# EAGLE design LickSensor (EAGLE 9.4.2)
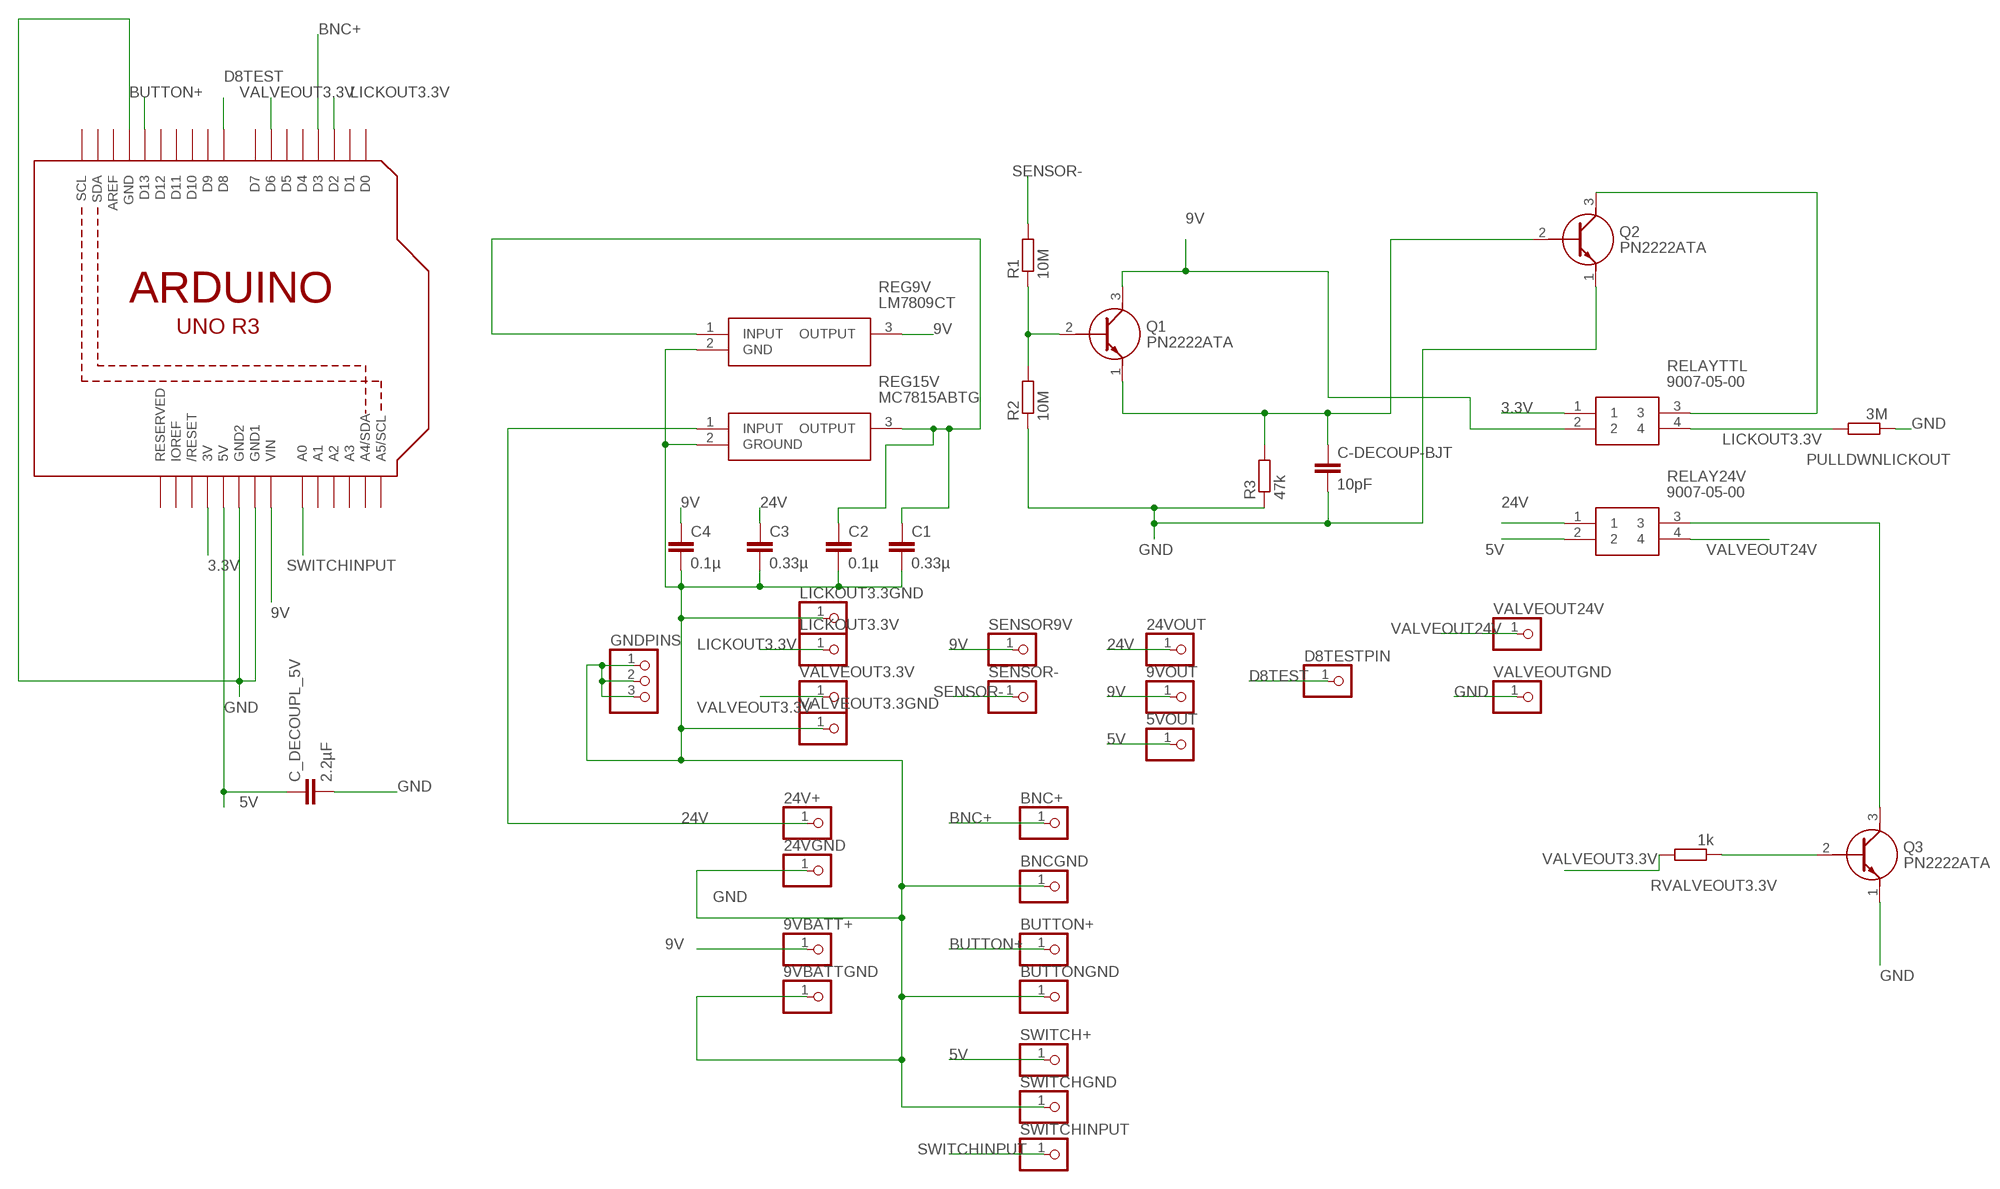
[diagram p0: schematic, sheet 1]

## Parts
5VOUT  PINHD-1X1  [1X01]
9VBATT+  PINHD-1X1  [1X01]
9VBATTGND  PINHD-1X1  [1X01]
9VOUT  PINHD-1X1  [1X01]
24V+  PINHD-1X1  [1X01]
24VGND  PINHD-1X1  [1X01]
24VOUT  PINHD-1X1  [1X01]
BNC+  PINHD-1X1  [1X01]
BNCGND  PINHD-1X1  [1X01]
BUTTON+  PINHD-1X1  [1X01]
BUTTONGND  PINHD-1X1  [1X01]
C1  0.33µ  C5/2.5  [C5B2.5]
C2  0.1µ  C5/2.5  [C5B2.5]
C3  0.33µ  C5/2.5  [C5B2.5]
C4  0.1µ  C5/2.5  [C5B2.5]
C-DECOUP-BJT  10pF  C-EU050-030X075  [C050-030X075]
C_DECOUPL_5V  2.2µF  C-EU050-030X075  [C050-030X075]
D8TESTPIN  PINHD-1X1  [1X01]
GNDPINS  PINHD-1X3  [1X03]
LICKOUT3.3GND  PINHD-1X1  [1X01]
LICKOUT3.3V  PINHD-1X1  [1X01]
PULLDWNLICKOUT  3M  R-EU_0207/10  [0207/10]
Q1  PN2222ATA  [TO-92-3]
Q2  PN2222ATA  [TO-92-3]
Q3  PN2222ATA  [TO-92-3]
R1  10M  R-EU_0207/7  [0207/7]
R2  10M  R-EU_0207/7  [0207/7]
R3  47k  R-EU_0207/7  [0207/7]
REG9V  LM7809CT  [TO254P470X1016X2019-3P]
REG15V  MC7815ABTG  [TO254P482X997X2018-3P]
RELAY24V  9007-05-00  [9007]
RELAYTTL  9007-05-00  [9007]
RVALVEOUT3.3V  1k  R-EU_0207/10  [0207/10]
SENSOR9V  PINHD-1X1  [1X01]
SENSOR-  PINHD-1X1  [1X01]
SWITCH+  PINHD-1X1  [1X01]
SWITCHGND  PINHD-1X1  [1X01]
SWITCHINPUT  PINHD-1X1  [1X01]
U1  ARDUINOR3-DIMENSION  [ARDUINOR3]
VALVEOUT3.3GND  PINHD-1X1  [1X01]
VALVEOUT3.3V  PINHD-1X1  [1X01]
VALVEOUT24V  PINHD-1X1  [1X01]
VALVEOUTGND  PINHD-1X1  [1X01]

## Nets
3.3V: RELAYTTL.1 U1.3V
5V: 5VOUT.1 C_DECOUPL_5V.1 RELAY24V.2 SWITCH+.1 U1.5V
9V: 9VBATT+.1 9VOUT.1 C4.1 Q1.3(C) REG9V.3(OUTPUT) RELAYTTL.2 SENSOR9V.1 U1.VIN
24V: 24V+.1 24VOUT.1 C3.1 REG15V.1(INPUT) RELAY24V.1
BNC+: BNC+.1 U1.D3
BUTTON+: BUTTON+.1 U1.D13
D8TEST: D8TESTPIN.1 U1.D8
GND: 9VBATTGND.1 24VGND.1 BNCGND.1 BUTTONGND.1 C1.2 C2.2 C3.2 C4.2 C-DECOUP-BJT.2 C_DECOUPL_5V.2 GNDPINS.1 GNDPINS.2 GNDPINS.3 LICKOUT3.3GND.1 PULLDWNLICKOUT.1 Q2.1(E) Q3.1(E) R2.1 R3.1 REG9V.2(GND) REG15V.2(GROUND) SWITCHGND.1 U1.GND U1.GND1 U1.GND2 VALVEOUT3.3GND.1 VALVEOUTGND.1
LICKOUT3.3V: LICKOUT3.3V.1 PULLDWNLICKOUT.2 RELAYTTL.4 U1.D2
N$1: Q3.2(B) RVALVEOUT3.3V.1
N$3: Q3.3(C) RELAY24V.3
N$5: C1.1 C2.1 REG9V.1(INPUT) REG15V.3(OUTPUT)
N$10: C-DECOUP-BJT.1 Q1.1(E) Q2.2(B) R3.2
N$11: Q1.2(B) R1.1 R2.2
N$14: Q2.3(C) RELAYTTL.3
SENSOR-: R1.2 SENSOR-.1
SWITCHINPUT: SWITCHINPUT.1 U1.A0
VALVEOUT3.3V: RVALVEOUT3.3V.2 U1.D6 VALVEOUT3.3V.1
VALVEOUT24V: RELAY24V.4 VALVEOUT24V.1
Unconnected: U1.A1 U1.A2 U1.A3 U1.A4(A4/SDA) U1.A5(A5/SCL) U1.AREF U1.D0 U1.D1 U1.D4 U1.D5 U1.D7 U1.D9 U1.D10 U1.D11 U1.D12 U1.IOREF U1.RESERVED U1.RESET(/RESET) U1.SCL U1.SDA

## Library data of the parts
5VOUT 9VBATT+ 9VBATTGND 9VOUT 24V+ 24VGND 24VOUT BNC+ BNCGND BUTTON+ BUTTONGND D8TESTPIN LICKOUT3.3GND LICKOUT3.3V SENSOR9V SENSOR- SWITCH+ SWITCHGND SWITCHINPUT VALVEOUT3.3GND VALVEOUT3.3V VALVEOUT24V VALVEOUTGND = adafruit:PINHD-1X1: Pin header 1x1 for 0.1" spacing With round pins
C1-C4 = capacitor-wima:C: CAPACITOR naming: grid - package width
C-DECOUP-BJT C_DECOUPL_5V = rcl:C-EU: CAPACITOR, European symbol; SPICEPREFIX: C
GNDPINS = adafruit:PINHD-1X3: PIN HEADER
PULLDWNLICKOUT R1-R3 RVALVEOUT3.3V = rcl:R-EU_: RESISTOR, European symbol; SPICEPREFIX: R
Q1-Q3 = SamacSys_Parts:PN2222ATA: Transistor GP BJT NPN 40V 1A TO92 3 Pin Source: Datasheet <https://componentsearchengine.com/Datasheets/2/PN2222ATA.pdf>; DESCRIPTION: Transistor GP BJT NPN 40V 1A TO92 3 Pin; HEIGHT: mm; MANUFACTURER_NAME: Fairchild Semiconductor; MANUFACTURER_PART_NUMBER: PN2222ATA; MOUSER_PART_NUMBER: 512-PN2222ATA; MOUSER_PRICE-STOCK: https://www.mouser.com/Search/Refine.aspx?Keyword=512-PN2222ATA
REG9V = SamacSys_Parts:LM7809CT: ON SEMICONDUCTOR - LM7809CT - LINEAR VOLT REG, 1A, 9V, TO-220AB-3 Source: Datasheet <https://mouser.componentsearchengine.com/Datasheets/2/LM7809CT.pdf>; DESCRIPTION: ON SEMICONDUCTOR - LM7809CT - LINEAR VOLT REG, 1A, 9V, TO-220AB-3; HEIGHT: 4.7mm; MANUFACTURER_NAME: ON Semiconductor; MANUFACTURER_PART_NUMBER: LM7809CT; MOUSER_PART_NUMBER: 512-LM7809CT; MOUSER_PRICE-STOCK: https://www.mouser.com/Search/Refine.aspx?Keyword=512-LM7809CT; RS_PART_NUMBER: 7044016; RS_PRICE-STOCK: https://uk.rs-online.com/web/p/products/7044016
REG15V = SamacSys_Parts:MC7815ABTG: MC7815ABTG, Voltage Regulator, 2.2A 15 V, +/-2%, 3-Pin TO-220 Source: Datasheet <http://www.onsemi.com/pub/Collateral/MC7800-D.PDF>; ALLIED_NUMBER: 70340130; ALLIED_PRICE-STOCK: http://www.alliedelec.com/on-semiconductor-mc7815abtg/70340130/; DESCRIPTION: MC7815ABTG, Voltage Regulator, 2.2A 15 V, +/-2%, 3-Pin TO-220; HEIGHT: 4.82mm; MANUFACTURER_NAME: ON Semiconductor; MANUFACTURER_PART_NUMBER: MC7815ABTG; MOUSER_PART_NUMBER: 863-MC7815ABTG; MOUSER_PRICE-STOCK: https://www.mouser.com/Search/Refine.aspx?Keyword=863-MC7815ABTG; RS_PART_NUMBER: 5165944P; RS_PRICE-STOCK: http://uk.rs-online.com/web/p/products/5165944P
RELAY24V RELAYTTL = SamacSys_Parts:9007-05-00: COTO TECHNOLOGY - 9007-05-00 - RELAY, REED, SPST-NO, 200V, 0.5A, THT Source: Datasheet <https://cotorelay.com/wp-content/uploads/2014/09/9007_series_reed_relay_datasheet.pdf>; DESCRIPTION: COTO TECHNOLOGY - 9007-05-00 - RELAY, REED, SPST-NO, 200V, 0.5A, THT; HEIGHT: mm; MANUFACTURER_NAME: Coto Technology; MANUFACTURER_PART_NUMBER: 9007-05-00; MOUSER_PART_NUMBER: 816-9007-05-00; MOUSER_PRICE-STOCK: https://www.mouser.com/Search/Refine.aspx?Keyword=816-9007-05-00
U1 = adafruit:ARDUINOR3: This is a new object for the new Arduino R3 - with extra pins that you may want to use (such as IOref, and duplicated A4/A5

## Board
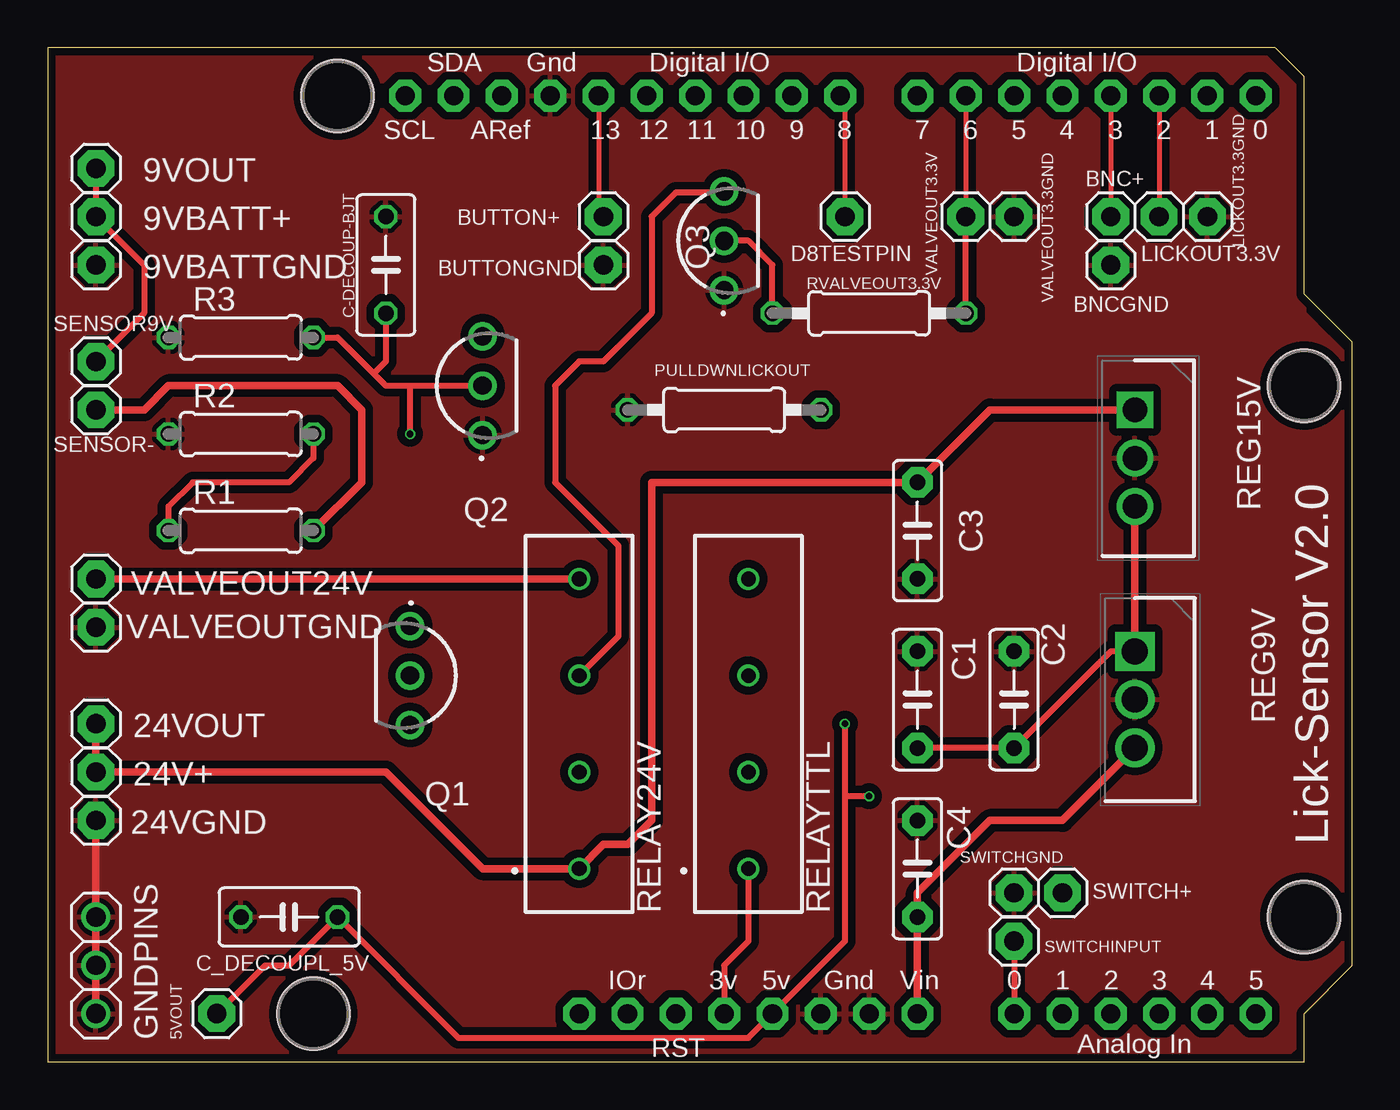
[diagram p1: board, top side]
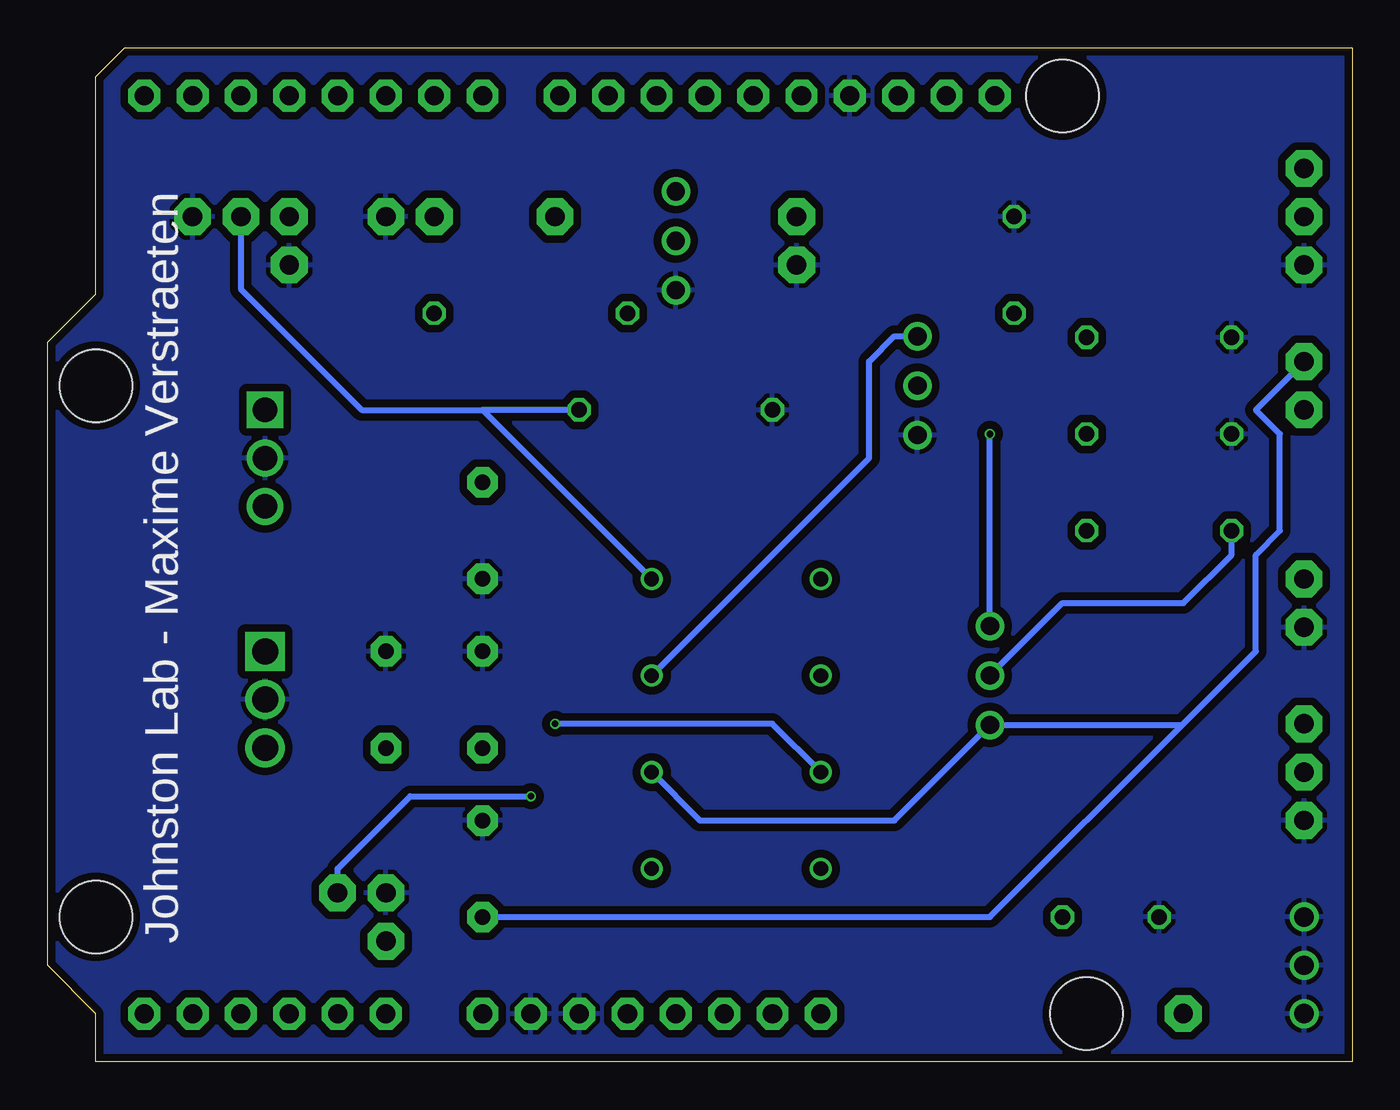
[diagram p2: board, bottom side, seen from below]

Size 68.58 x 53.34 mm. Coordinates in mm from the lower left corner, seen from the top.
Copper layers (1*16): Top 0.035559375mm / dielectric 1.6mm / Bottom 0.035559375mm
Design rules "jlcpcb2layer": minimum track width 5mil, minimum drill 12mil, track to track 5mil, track to pad 5mil, pad to pad 5mil, via to via 5mil, smd to smd 5mil, copper to edge 8mil, drill to drill 6mil, minimum pad ring 5mil, minimum via ring 3mil, stop-mask expansion 2.5mil, vias tented up to drill 0mil, thermal gap 10mil
Holes 3.81 mm at 15.24,50.8 66.04,35.56 66.04,7.62 13.97,2.54

### Footprints (pad centres in the part's own frame; a part is rotated, then mirrored left to right if it is on the bottom)
1X01 = drill 1.016 pad 1.93 octagon: 1 0,0
C5B2.5 = drill 0.813 pad 1.6 octagon: 1 -2.54,0; 2 2.54,0
C050-030X075 = drill 0.813 octagon: 1 -2.54,0; 2 2.54,0
1X03 = drill 1.016: 1 -2.54,0; 2 0,0; 3 2.54,0
0207/10 = drill 0.813 octagon: 1 -5.08,0; 2 5.08,0
TO-92-3 = drill 0.96 pad 1.5: 1 -2.6,0; 2 0,0; 3 2.6,0
0207/7 = drill 0.813 octagon: 1 -3.81,0; 2 3.81,0
TO254P470X1016X2019-3P = drill 1.37 pad 2.055 square: 1 0,0 | drill 1.37 pad 2.055: 2 2.535,0; 3 5.07,0
TO254P482X997X2018-3P = drill 1.29 pad 1.935 square: 1 0,0 | drill 1.29 pad 1.935: 2 2.54,0; 3 5.08,0
9007 = drill 0.77 pad 1.17: 1 -7.62,0; 2 -2.54,0; 3 2.54,0; 4 7.62,0
ARDUINOR3 = drill 1 pad 1.676 octagon: 3V 35.56,2.54; 5V 38.1,2.54; A0 50.8,2.54; A1 53.34,2.54; A2 55.88,2.54; A3 58.42,2.54; A4 60.96,2.54; A5 63.5,2.54; AREF 23.876,50.8; D0 63.5,50.8; D1 60.96,50.8; D2 58.42,50.8; D3 55.88,50.8; D4 53.34,50.8; D5 50.8,50.8; D6 48.26,50.8; D7 45.72,50.8; D8 41.656,50.8; D9 39.116,50.8; D10 36.576,50.8; D11 34.036,50.8; D12 31.496,50.8; D13 28.956,50.8; GND 26.416,50.8; GND1 43.18,2.54; GND2 40.64,2.54; IOREF 30.48,2.54; RESERVED 27.94,2.54; RESET 33.02,2.54; SCL 18.796,50.8; SDA 21.336,50.8; VIN 45.72,2.54

### Placement (x,y rotation side)
5VOUT  8.89,2.54 0 top
9VBATT+  2.54,44.45 0 top
9VBATTGND  2.54,41.91 0 top
9VOUT  2.54,46.99 0 top
24V+  2.54,15.24 0 top
24VGND  2.54,12.7 0 top
24VOUT  2.54,17.78 0 top
BNC+  55.88,44.45 0 top
BNCGND  55.88,41.91 0 top
BUTTON+  29.21,44.45 0 top
BUTTONGND  29.21,41.91 0 top
C1  45.72,19.05 90 top
C2  50.8,19.05 90 top
C3  45.72,27.94 270 top
C4  45.72,10.16 90 top
C-DECOUP-BJT  17.78,41.91 90 top
C_DECOUPL_5V  12.7,7.62 180 top
D8TESTPIN  41.91,44.45 0 top
GNDPINS  2.54,5.08 90 top
LICKOUT3.3GND  60.96,44.45 0 top
LICKOUT3.3V  58.42,44.45 0 top
PULLDWNLICKOUT  35.56,34.29 0 top
Q1  19.05,20.32 270 top
Q2  22.86,35.56 90 top
Q3  35.56,43.18 90 top
R1  10.16,27.94 0 top
R2  10.16,33.02 0 top
R3  10.16,38.1 0 top
REG9V  57.15,21.59 270 top
REG15V  57.15,34.29 270 top
RELAY24V  27.94,17.78 90 top
RELAYTTL  36.83,17.78 90 top
RVALVEOUT3.3V  43.18,39.37 0 top
SENSOR9V  2.54,36.83 0 top
SENSOR-  2.54,34.29 0 top
SWITCH+  53.34,8.89 0 top
SWITCHGND  50.8,8.89 0 top
SWITCHINPUT  50.8,6.35 0 top
U1  0,0 0 top
VALVEOUT3.3GND  50.8,44.45 0 top
VALVEOUT3.3V  48.26,44.45 0 top
VALVEOUT24V  2.54,25.4 0 top
VALVEOUTGND  2.54,22.86 0 top

### Tracks (layer width: path | path; a pad name or v marks a point on that pad's centre or on a via)
3.3V
  Top 0.305: RELAYTTL.1 36.83,6.35 35.56,5.08 U1.3V
5V  (via drill 0.35)
  Top 0.305: v41.91,17.78 41.91,13.97 | 41.91,13.97 41.91,6.35 U1.5V 36.83,1.27 21.59,1.27 C_DECOUPL_5V.1 12.7,5.08 11.43,5.08 5VOUT.1 | v43.18,13.97 41.91,13.97
  Bottom 0.305: RELAY24V.2 30.48,17.78 v41.91,17.78 | SWITCH+.1 53.34,10.16 49.53,13.97 v43.18,13.97
9V
  Top 0.305: 9VOUT.1 9VBATT+.1 5.08,41.91 5.08,39.37 SENSOR9V.1
  Top 0.406: U1.VIN C4.1 45.72,8.89 49.53,12.7 53.33,12.7 REG9V.3
  Bottom 0.305: C4.1 19.05,7.62 8.95,17.72 | SENSOR9V.1 5.08,34.29 3.81,33.02 3.81,27.94 5.08,26.67 5.08,21.59 8.89,17.78 8.95,17.72 | RELAYTTL.2 34.29,12.7 24.07,12.7 Q1.3 8.95,17.72
24V
  Top 0.406: 24VOUT.1 24V+.1 17.78,15.24 22.86,10.16 RELAY24V.1 29.21,11.43 30.48,11.43 31.75,12.7 31.75,30.48 C3.1 49.53,34.29 REG15V.1
BNC+
  Top 0.254: U1.D3 BNC+.1
BUTTON+
  Top 0.254: U1.D13 28.96,44.7 BUTTON+.1
D8TEST
  Top 0.254: U1.D8 41.91,50.55 D8TESTPIN.1
GND
  Top 0.406: 24VGND.1 GNDPINS.3 GNDPINS.2 GNDPINS.1
  pour Top (isolate 0.406): 0,53.34 0,0 64.77,0 66.04,1.27 66.04,2.54 68.58,5.08 68.58,36.83 67.31,38.1 66.04,39.37 66.04,50.8 63.5,53.34
  pour Bottom (isolate 0.406): 0,53.34 0,0 66.04,0 66.04,2.54 68.58,5.08 68.58,38.1 66.04,40.64 66.04,52.07 64.77,53.34
LICKOUT3.3V
  Top 0.254: U1.D2 LICKOUT3.3V.1
  Bottom 0.305: LICKOUT3.3V.1 58.42,40.64 52.07,34.29 45.72,34.29 | 45.72,34.29 RELAYTTL.4 | PULLDWNLICKOUT.2 45.72,34.29
N$1
  Top 0.305: RVALVEOUT3.3V.1 38.1,41.91 36.83,43.18 Q3.2
N$3
  Top 0.305: Q3.3 35.5,45.72 33.02,45.72 31.75,44.45 31.75,39.37 29.21,36.83 27.94,36.83 26.67,35.56 26.67,30.48 30,27.15 30,22.38 RELAY24V.3
N$5
  Top 0.305: C1.1 C2.1 55.88,21.59 REG9V.1
  Top 0.406: REG15V.3 REG9V.1
N$10  (via drill 0.35)
  Top 0.305: R3.2 15.24,38.1 17.14,36.2 | 17.14,36.2 17.78,35.56 19.05,35.56 | 19.05,35.56 Q2.2 | v19.05,33.02 19.05,35.56 | C-DECOUP-BJT.1 17.78,36.83 17.14,36.2
  Bottom 0.305: Q1.1 v19.05,33.02
N$11
  Top 0.305: R2.2 13.97,31.75 12.7,30.48 7.62,30.48 6.35,29.21 R1.1
  Bottom 0.305: Q1.2 15.24,24.13 8.89,24.13 6.35,26.67 R1.1
N$14
  Bottom 0.305: RELAYTTL.3 25.4,31.75 25.4,36.83 24.07,38.16 Q2.3
SENSOR-
  Top 0.406: R1.2 16.51,30.48 16.51,34.29 15.24,35.56 6.35,35.56 5.08,34.29 SENSOR-.1
SWITCHINPUT
  Top 0.305: SWITCHINPUT.1 U1.A0
VALVEOUT3.3V
  Top 0.254: U1.D6 VALVEOUT3.3V.1
  Top 0.305: RVALVEOUT3.3V.2 VALVEOUT3.3V.1
VALVEOUT24V
  Top 0.406: VALVEOUT24V.1 RELAY24V.4

### Text on the board
tPlace: Lick-Sensor V2.0
bPlace: Johnston Lab - Maxime Verstraeten